# Altium schematic sheet HyperRAM2.SchDoc: Pulp FMC Sensor Board
size A4; Author: A. Blanco Fontao; CompanyName: ETHZ; DrawnBy: A. Blanco Fontao; Organization: Microelectronics Design Center; Address1: Gloriastrasse 35; Address2: 8092 Zurich; Address3: Switzerland; SheetNumber: 5; SheetTotal: 7
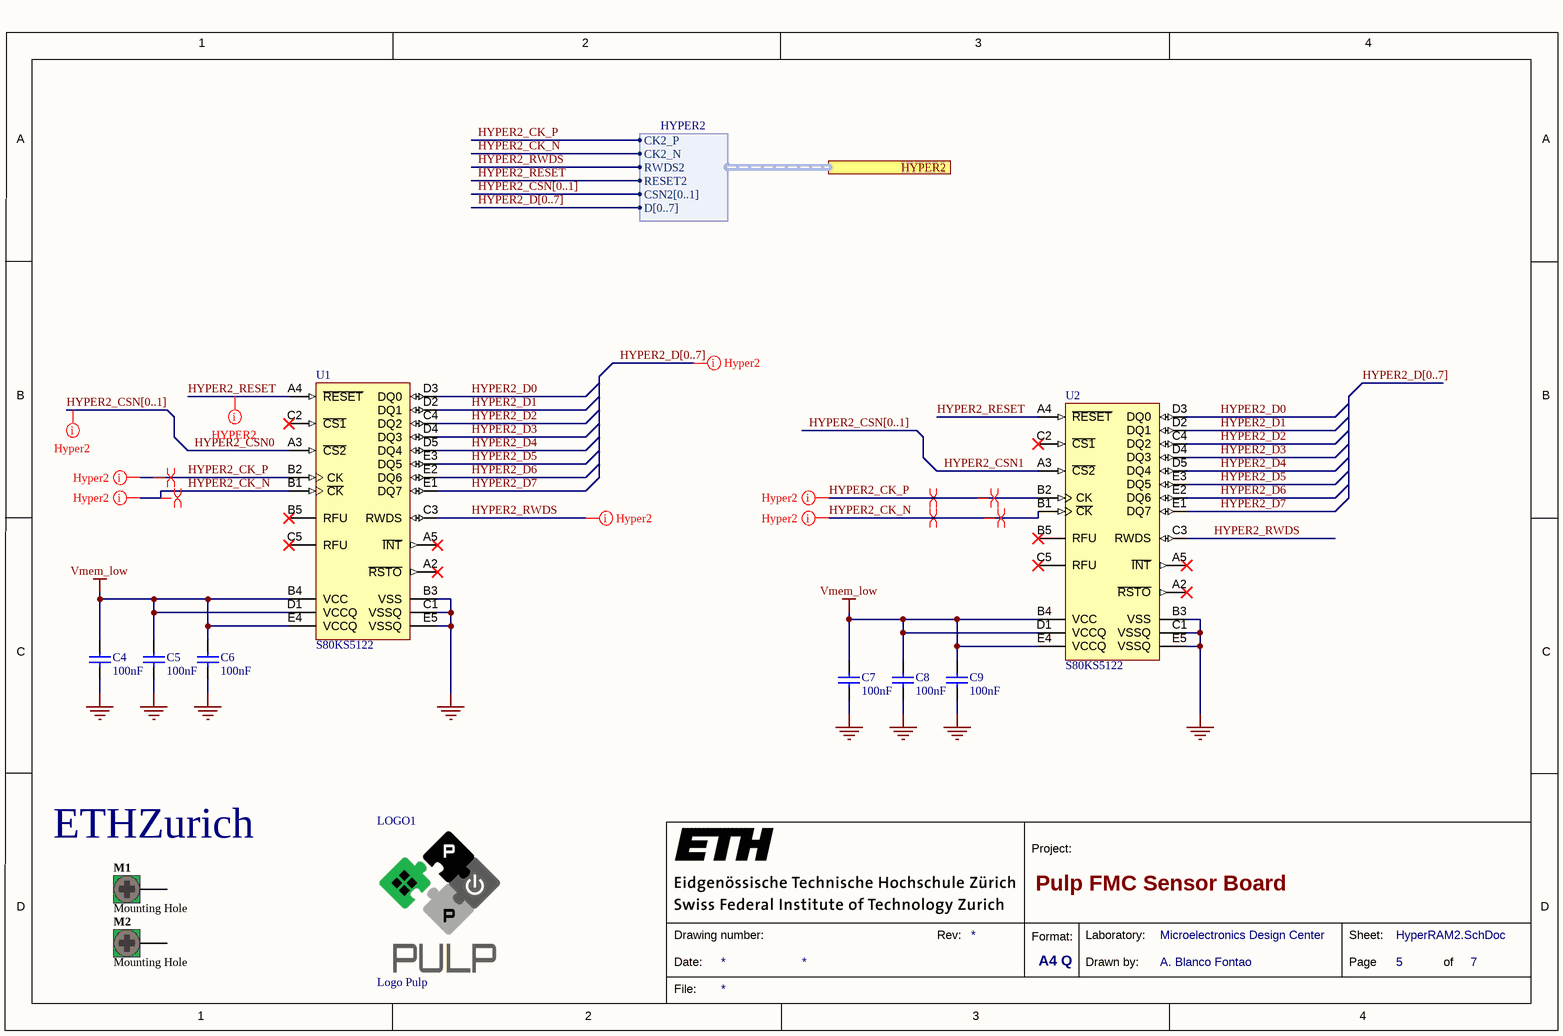
[diagram p0: HyperRAM2.SchDoc]

## Parts
A1  Logo ETH Zurich  [eth-zurich_3mm]  (value not drawn)  (no BOM)
C4  value 100nF  [CAPC0603(1608)100_N]  (hidden comment: CAP 100nF 25V 0603(1608))
C5  value 100nF  [CAPC0603(1608)100_N]  (hidden comment: CAP 100nF 25V 0603(1608))
C6  value 100nF  [CAPC0603(1608)100_N]  (hidden comment: CAP 100nF 25V 0603(1608))
C7  value 100nF  [CAPC0603(1608)100_N]  (hidden comment: CAP 100nF 25V 0603(1608))
C8  value 100nF  [CAPC0603(1608)100_N]  (hidden comment: CAP 100nF 25V 0603(1608))
C9  value 100nF  [CAPC0603(1608)100_N]  (hidden comment: CAP 100nF 25V 0603(1608))
LOGO1  Logo Pulp  [Logo Pulp]  (no BOM)
M1  Mounting Hole  [Hole M3]  (no BOM)
M2  Mounting Hole  [Hole M3]  (no BOM)
U1  S80KS5122  [FBGA24_A-130]
U2  S80KS5122  [FBGA24_A-130]

## Ports
HYPER2 (harness HYPER2)

## Harnesses
HYPER2: D[0..7], CK2_P, CK2_N, RWDS2, CSN2[0..1], RESET2

## Nets
GND: C4.1 C5.1 C6.1 C7.1 C8.1 C9.1 U1.B3(VSS) U1.C1(VSSQ) U1.E5(VSSQ) U2.B3(VSS) U2.C1(VSSQ) U2.E5(VSSQ)
Vmem_low: C4.2 C5.2 C6.2 C7.2 C8.2 C9.2 U1.B4(VCC) U1.D1(VCCQ) U1.E4(VCCQ) U2.B4(VCC) U2.D1(VCCQ) U2.E4(VCCQ)
HYPER2_CK_N: U1.B1(~{CK}) U2.B1(~{CK}) ; port HYPER2.CK2_N
HYPER2_CK_P: U1.B2(CK) U2.B2(CK) ; port HYPER2.CK2_P
HYPER2_CSN0: U1.A3(~{CS2})
HYPER2_CSN1: U2.A3(~{CS2})
HYPER2_D0: U1.D3(DQ0) U2.D3(DQ0)
HYPER2_D1: U1.D2(DQ1) U2.D2(DQ1)
HYPER2_D2: U1.C4(DQ2) U2.C4(DQ2)
HYPER2_D3: U1.D4(DQ3) U2.D4(DQ3)
HYPER2_D4: U1.D5(DQ4) U2.D5(DQ4)
HYPER2_D5: U1.E3(DQ5) U2.E3(DQ5)
HYPER2_D6: U1.E2(DQ6) U2.E2(DQ6)
HYPER2_D7: U1.E1(DQ7) U2.E1(DQ7)
HYPER2_RESET: U1.A4(~{RESET}) U2.A4(~{RESET}) ; port HYPER2.RESET2
HYPER2_RWDS: U1.C3(RWDS) U2.C3(RWDS) ; port HYPER2.RWDS2

Not connected (* = marked no-connect by the designer): M1 1; M2 1; U1 A2(~{RSTO})* A5(~{INT})* B5(RFU)* C2(~{CS1})* C5(RFU)*; U2 A2(~{RSTO})* A5(~{INT})* B5(RFU)* C2(~{CS1})* C5(RFU)*

## Buses and harness runs
bus HYPER2_CSN[0..1]
bus HYPER2_D[0..7]

## Layout directives
differential pair: HYPER2_CK_N, HYPER2_CK_P
mark named HYPER2: HYPER2_RESET
net class Hyper2: (no net found under the mark), HYPER2_CK_N, HYPER2_CK_P, HYPER2_RWDS

## Notes on the sheet
- 1
- 2
- 3
- 4
- A
- B
- C
- Project:
- D
- Date:
- Drawing number:
- Rev:
- Format:
- A4 Q
- Drawn by:
- Laboratory:
- Page
- Sheet:
- of
- File:
- (in symbol CMP-00038-1) ETHZurich

## Library data of the parts
A1 = CMP-00038-1
C4-C9 = CMP-1035-02588-1: CAP 100nF 25V ±10% 0603 (1608 Metric) Thickness 1mm SMD; Case-Metric: 1608; Case-EIA: 0603; Tolerance: Â±10%; Max Thickness: 1 mm; Technology: SMT; Rated Voltage: 25 V
LOGO1 = CMP-00145-1: 4 Layers: only valid for layer stack as defined for the TestBoards
M1 M2 = CMP-00023-1: Mounting Hole, 7.2mm pad, 3.2mm plated hole; ClassName: Mounting Hole
U1 U2 = CMP-00514-1: 512 Mb: HYPERRAM™ self-refresh dynamic / RAM (DRAM) with HYPERBUS™ interface / 1.8 V; Manufacturer: Cypress Semiconductor Corp; Memory Format: FLASH, RAM; Memory Type: Non-Volatile; Memory Size: 512Mbit Flash, 64Mbit RAM; Speed: 100MHz; Interface: Parallel, Serial; Voltage - Supply: 1.8V; Series: HyperFlash™ + HyperRAM™ KS; Package / Case: 24-VBGA; Supplier Device Package: 24-FBGA(6x8)